# Altium project WCHLinkE.PrjPcb
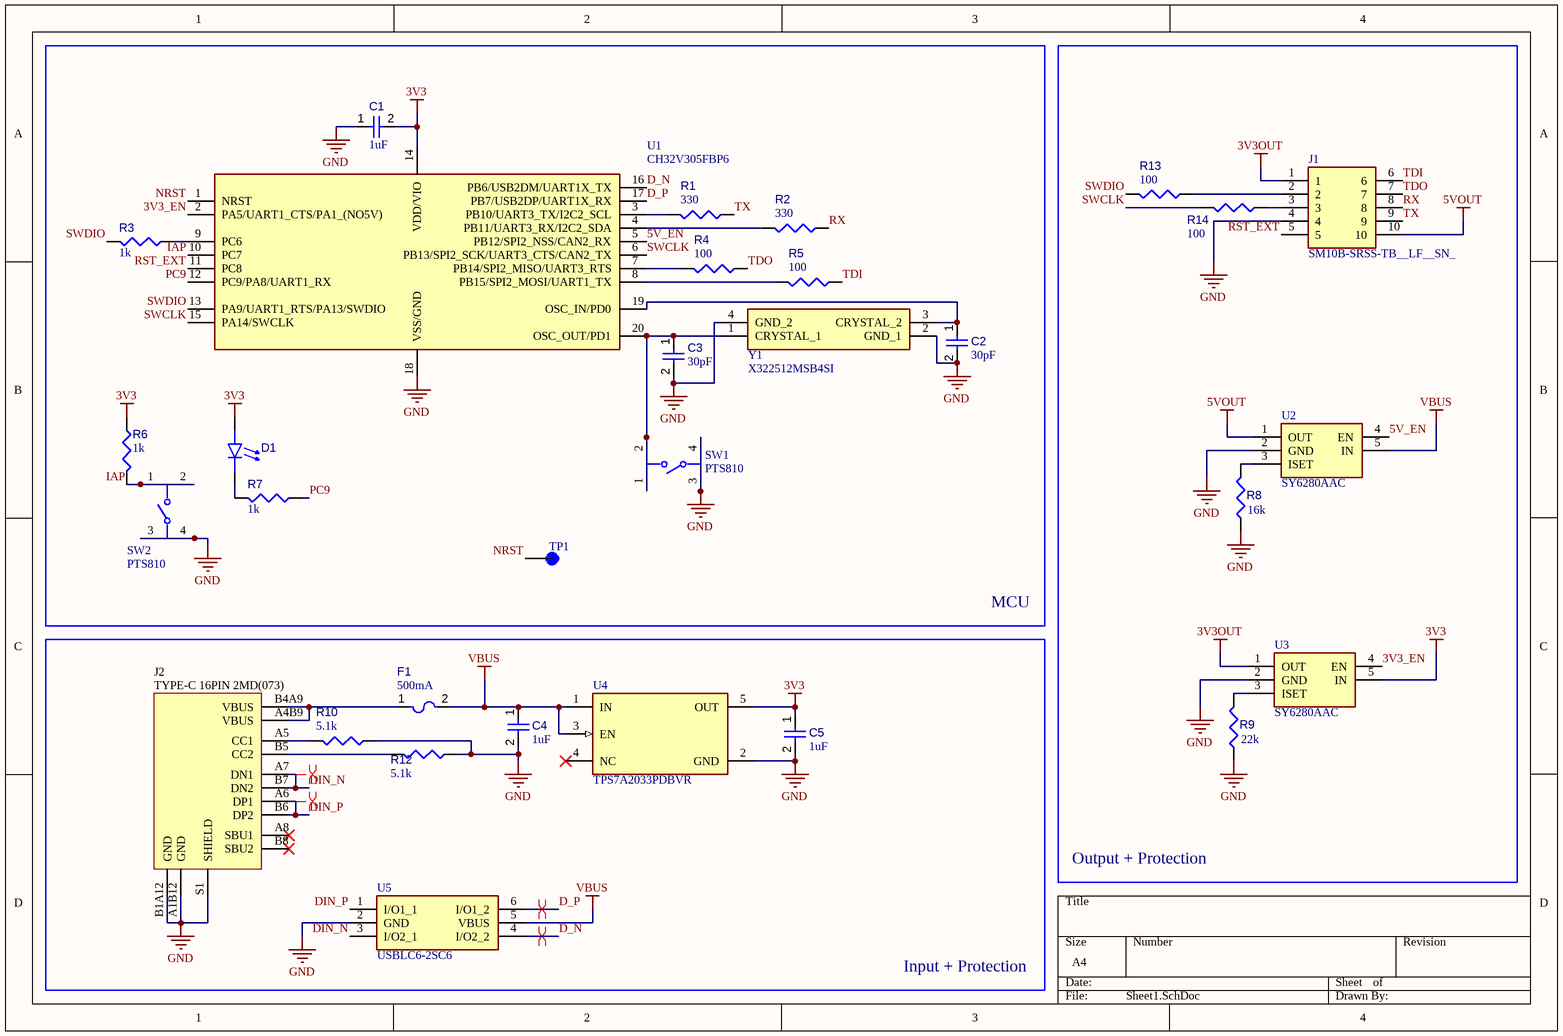
[diagram p0: Sheet1.SchDoc]
1 sheet, 31 parts. Net scope: global (net labels, ports and power ports of the same name join across sheets).
Board file: PCB1.PcbDoc

## Sheet Sheet1.SchDoc
size A4; SheetNumber: 1; SheetTotal: 1

### Parts
C1  value 1uF  [CAP 0603_1608]  (hidden comment: Capacitors,C126631,1uF)
C2  value 30pF  [CAP 0402_1005]  (hidden comment: Capacitors,C526980,30pF)
C3  value 30pF  [CAP 0402_1005]  (hidden comment: Capacitors,C526980,30pF)
C4  value 1uF  [CAP 0603_1608]  (hidden comment: Capacitors,C126631,1uF)
C5  value 1uF  [CAP 0603_1608]  (hidden comment: Capacitors,C126631,1uF)
D1  KT-0805G  [KT-0805G]  (value not drawn)
F1  Current Rating: 500mA  [LFUS-467_V]  (hidden comment: Fuses,500mA,C7472536)
J1  SM10B-SRSS-TB__LF__SN_  [SM10B-SRSS-TB]
J2  TYPE-C 16PIN 2MD(073)  [USB-C-SMD_TYPE-C-16PIN-2MD-073]
R1  value 330  [RESC0402(1005)_L]  (hidden comment: Resistors,C25104,330)
R2  value 330  [RESC0402(1005)_L]  (hidden comment: Resistors,C25104,330)
R3  value 1k  [RESC0402(1005)_L]  (hidden comment: Resistors,C11702,1k)
R4  value 100  [RESC0402(1005)_L]  (hidden comment: Resistors,C25076,100)
R5  value 100  [RESC0402(1005)_L]  (hidden comment: Resistors,C25076,100)
R6  value 1k  [RESC0402(1005)_L]  (hidden comment: Resistors,C11702,1k)
R7  value 1k  [RESC0402(1005)_L]  (hidden comment: Resistors,C11702,1k)
R8  value 16k  [RESC0402(1005)_L]  (hidden comment: Resistors,C25759,16k)
R9  value 22k  [RESC0402(1005)_L]  (hidden comment: Resistors,C25768,22k)
R10  value 5.1k  [RESC0402(1005)_L]  (hidden comment: Resistors,C25905,5.1k)
R12  value 5.1k  [RESC0402(1005)_L]  (hidden comment: Resistors,C25905,5.1k)
R13  value 100  [RESC0402(1005)_L]  (hidden comment: Resistors,C25076,100)
R14  value 100  [RESC0402(1005)_L]  (hidden comment: Resistors,C25076,100)
SW1  PTS810  [FP-PTS810_SJG_250_SMTR_LF-MFG]
SW2  PTS810  [FP-PTS810_SJG_250_SMTR_LF-MFG]
TP1  5000  [KEYSTONE_5000]  (value not drawn)
U1  CH32V305FBP6  [SOP65P640X110-20N]
U2  SY6280AAC  [SOT95P285X140-5N]
U3  SY6280AAC  [SOT95P285X140-5N]
U4  TPS7A2033PDBVR  [FP-DBV0005A-IPC_B]
U5  USBLC6-2SC6  [SOT95P280X145-6N]
Y1  X322512MSB4SI  [X322512MSB4SI]

### Blocks framed on the sheet
MCU: C1-C3 D1 R1-R7 SW1 SW2 TP1 U1 Y1
Output + Protection: J1 R8 R9 R13 R14 U2 U3
Input + Protection: C4 C5 F1 J2 R10 R12 U4 U5

### Nets
3V3: C1.2 C5.1 D1.2(A) R6.1 U1.14(VDD/VIO) U3.5(IN) U4.5(OUT)
3V3OUT: J1.1 U3.1(OUT)
5VOUT: J1.10 U2.1(OUT)
GND: C1.1 C2.2 C3.2 C4.2 C5.2 J1.4 J2.A1B12(GND) J2.B1A12(GND) J2.S1(SHIELD) R8.1 R9.1 R10.1 R12.1 SW1.3 SW1.4 SW2.3 SW2.4 U1.18(VSS/GND) U2.2(GND) U3.2(GND) U4.2(GND) U5.2(GND) Y1.2(GND_1) Y1.4(GND_2)
VBUS: C4.1 F1.2 U2.5(IN) U4.1(IN) U4.3(EN) U5.5(VBUS)
3V3_EN: U1.2(PA5/UART1_CTS/PA1_(NO5V)) U3.4(EN)
5V_EN: U1.5(PB12/SPI2_NSS/CAN2_RX) U2.4(EN)
D_N: U1.16(PB6/USB2DM/UART1X_TX) U5.4(I/O2_2)
D_P: U1.17(PB7/USB2DP/UART1X_RX) U5.6(I/O1_2)
DIN_N: J2.A7(DN1) J2.B7(DN2) U5.3(I/O2_1)
DIN_P: J2.A6(DP1) J2.B6(DP2) U5.1(I/O1_1)
IAP: R6.2 SW2.1 SW2.2 U1.10(PC7)
NRST: TP1.TP U1.1(NRST)
PC9: R7.1 U1.12(PC9/PA8/UART1_RX)
RST_EXT: J1.5 U1.11(PC8)
RX: J1.8 R2.1
SWCLK: R14.2 U1.6(PB13/SPI2_SCK/UART3_CTS/CAN2_TX) U1.15(PA14/SWCLK)
SWDIO: R3.2 R13.2 U1.13(PA9/UART1_RTS/PA13/SWDIO)
TDI: J1.6 R5.1
TDO: J1.7 R4.1
TX: J1.9 R1.1
NetC2_1: C2.1 U1.19(OSC_IN/PD0) Y1.3(CRYSTAL_2)
NetC3_1: C3.1 SW1.1 SW1.2 U1.20(OSC_OUT/PD1) Y1.1(CRYSTAL_1)
NetD1_1: D1.1(K) R7.2
NetF1_1: F1.1 J2.A4B9(VBUS) J2.B4A9(VBUS)
NetJ1_2: J1.2 R13.1
NetJ1_3: J1.3 R14.1
NetJ2_A5: J2.A5(CC1) R10.2
NetJ2_B5: J2.B5(CC2) R12.2
NetR1_2: R1.2 U1.3(PB10/UART3_TX/I2C2_SCL)
NetR2_2: R2.2 U1.4(PB11/UART3_RX/I2C2_SDA)
NetR3_1: R3.1 U1.9(PC6)
NetR4_2: R4.2 U1.7(PB14/SPI2_MISO/UART3_RTS)
NetR5_2: R5.2 U1.8(PB15/SPI2_MOSI/UART1_TX)
NetR8_2: R8.2 U2.3(ISET)
NetR9_2: R9.2 U3.3(ISET)

Not connected (* = marked no-connect by the designer): J2 A8(SBU1)* B8(SBU2)*; U4 4(NC)*

### Layout directives
differential pair: D_N, D_P, DIN_N, DIN_P

### Library data of the parts
C1-C5 = Capacitors: Capacitor; Component Type: Capacitors
  C1 C4 C5: LCSC: C126631
  C2 C3: LCSC: C526980
D1 = CMP-007-00006-5: -40℃~+85℃ 100mW 120° 2.6V~3.1V 430mcd 513nm~528nm 525nm 5mA Emerald Green 0805 LED Indication - Discrete ROHS; Forward Voltage: 2.6V; Nominal Vf: 2.7V; Mounting Technology: SMD; Case/Package: 0805; Pins: 2; RoHS Compliant: Yes; Min Operating Temperature: -40°C; Max Operating Temperature: 85°C; Colour: Emerald Green; Max Power Dissipation: 100mW; Forward Current: 5mA; LCSC: C84256
F1 = Fuses: Fuse; Component Type: Fuses; LCSC: C7472536
J1 = SM10B-SRSS-TB__LF__SN_: Connector; Manufacturer_Name: JST (JAPAN SOLDERLESS TERMINALS); Manufacturer_Part_Number: SM10B-SRSS-TB (LF)(SN); Datasheet Link: https://www.jst.co.uk/downloads/series/eSR_SZ_(21-04-14).pdf; Arrow Part Number: SM10B-SRSS-TB (LF)(SN); Arrow Price/Stock: https://www.arrow.com/en/products/sm10b-srss-tb-lf-sn/jst-manufacturing; LCSC: C5340780
J2 = TYPE-C_16PIN_2MD_073: USB-C (USB TYPE-C) Receptacle Connector 16 Position Surface Mount, Right Angle; LCSC: C165948
R1-R10 R12-R14 = Resistors: Resistor; Component Type: Resistors
  R1 R2: LCSC: C25104
  R3 R6 R7: LCSC: C11702
  R4 R5 R13 R14: LCSC: C25076
  R8: LCSC: C25759
  R9: LCSC: C25768
  R10 R12: LCSC: C25905
SW1 SW2 = CMP-10040-000011-1: SWITCH TACTILE SPST-NO 0.05A 16V; Manufacturer: C&K Components; Manufacturer Part Number: PTS810 SJG 250 SMTR LFS; Electromechanical Life: 100000Cycles; Contact Resistance: 500mΩ; Operating Force: 400gf; Current Rating: 50mA; Voltage Rating Dc: 16V; Device Class L2: Switches; Device Class L1: Electromechanical; ComponentLink2URL: https://www.ckswitches.com/media/1476/pts810.pdf; Digikey Description: SWITCH TACTILE SPST-NO 0.05A 16V; RoHS: TRUE; Temperature Range Low: -40°C; Temperature Range High: +85°C; Automotive: No; Category: Switch; ComponentLink2Description: Datasheet; Device Class L3: Tactile Switches; Mouser Description: Switch Tactile N.O. SPST Button J-Bend 0.05A 16VDC 100000Cycles 3.92N SMD T/R; Throw Configuration: SPST-NO; Package: PTS810 SJG 250 SMTR LFS; Height: 2.7mm; Octopart: https://octopart.com/pts810sjg250smtrlfs-c%26k+components-29380277; Temperature: -40°C to +85°C; Lead Free: Yes; LCSC: C5363473
TP1 = CMP-246-000000-1: Test Point Miniature THM H .300 Nylon 46 Insulated Red PhosBronze/Silver; MF: Keystone Electronics; Pin Count: 1; Value: *; SnapEDA_Link: https://www.snapeda.com/parts/5000/Keystone+Electronics/view-part/?ref=snap; Component Type: Standard; Source: 5000.SchLib; Package: Test Point Keystone Electronics; Check_prices: https://www.snapeda.com/parts/5000/Keystone+Electronics/view-part/?ref=eda; Design Item ID: 5000; MP: 5000
U1 = CH32V305FBP6: Integrated Circuit; Manufacturer_Name: WCH; Datasheet Link: https://lcsc.com/datasheet/lcsc_datasheet_2501141725_WCH-CH32V305FBP6_C5123443.pdf; Height: 1.1mm; Manufacturer_Part_Number: CH32V305FBP6; LCSC: C5123443
U2 U3 = SY6280AAC: Integrated Circuit; Manufacturer_Name: Olimex Ltd.; Manufacturer_Part_Number: SMD IC SY6280AAC; Datasheet Link: https://nl.mouser.com/datasheet/2/306/SY6280AAC-3223659.pdf; Height: 1.4mm; Mouser Part Number: 909-SMDICSY6280AAC; Mouser Price/Stock: https://www.mouser.co.uk/ProductDetail/Olimex-Ltd/SMD-IC-SY6280AAC?qs=9vOqFld9vZUuwGiRcx8i5w%3D%3D; LCSC: C55136
U4 = TPS7A2033PDBVR: IC REG LINEAR 3.3V 300MA SOT23-5; RoHS Compliant: Yes; LCSC: C2862740
U5 = USBLC6-2SC6: Integrated Circuit; Manufacturer_Name: STMicroelectronics; Datasheet Link: https://www.st.com/resource/en/datasheet/usblc6-2.pdf; Height: 1.45mm; Manufacturer_Part_Number: USBLC6-2SC6; Mouser Part Number: 511-USBLC6-2SC6; Mouser Price/Stock: https://www.mouser.co.uk/ProductDetail/STMicroelectronics/USBLC6-2SC6?qs=po45yt2pPpu%2FhNIlwQdTlg%3D%3D; Arrow Part Number: USBLC6-2SC6; Arrow Price/Stock: https://www.arrow.com/en/products/usblc6-2sc6/stmicroelectronics.html?utm_currency=USD&region=nac; LCSC: C2827654
Y1 = X322512MSB4SI: Crystal or Oscillator; Manufacturer_Name: Yangxing Tech; Datasheet Link: https://datasheet.lcsc.com/szlcsc/Yangxing-Tech-X322512MSB4SI_C9002.pdf; Height: 0.8mm; Manufacturer_Part_Number: X322512MSB4SI; LCSC: C9002